# Altium schematic sheet Power.SchDoc
size 431 x 279 mm; Organization: ORGANIZATION; Address1: ADDRESS 1; Address2: ADDRESS 2; Address3: ADDRESS 3; Address4: ADDRESS 4; Revision: -; SheetNumber: 3; SheetTotal: 4; ENG_APP_DATE: --/--/--; DSN_APP_DATE: --/--/--; CHK_APP_DATE: --/--/--
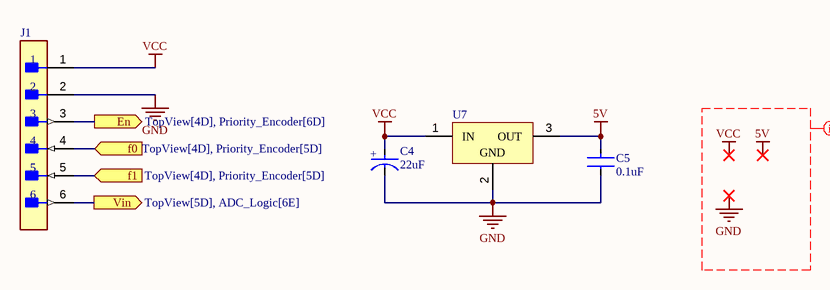
[diagram p0: Power.SchDoc]

## Parts
C4  22uF  [FP-RAD-TH-D_5_0_5-L_11_1-MFG]
C5  0.1uF  [FP-K15H5-MFG]
J1  22-28-4060  [FP-22-28-4060-MFG]  (value not drawn)
U7  MC7805CTG  [ONSC-TO-220-3-221AB-01]  (value not drawn)

## Ports
En (out, see TopView[4D], Priority_Encoder[6D]), f0 (in, see TopView[4D], Priority_Encoder[5D]), f1 (in, see TopView[4D], Priority_Encoder[5D]), Vin (out, see TopView[5D], ADC_Logic[6E])

## Nets
5V: C5.1 U7.3(OUT)
GND: C4.1(C) C5.2 J1.2 U7.2(GND)
VCC: C4.2(A) J1.1 U7.1(IN)
En: J1.3 ; port En
f0: J1.4 ; port f0
f1: J1.5 ; port f1
Vin: J1.6 ; port Vin

## Layout directives
net class Power; rule Width Constraint [Pref Width = 10mil    Min Width = 10mil    Max Width = 10mil]: 5V, GND, VCC

## Notes on the sheet
- Labels drawn without touching a wire or pin: 5V, GND, VCC
- DWG. NO.
- REV.
- SHT.
- THIS DOCUMENT AND THE DATA DISCLOSED HEREIN OR HEREWITH IS THE PROPERTY OF ALTIUM LIMITED AND MAY BE FREELY DISTRIBUTED IN WHOLE. NO RIGHTS ARE RESERVED OR EXPRESS OR IMPLIED WARANTEE GIVEN.
- REVISION
- DESCRIPTION
- DATE
- APPROVED
- ENG:
- APPROVALS
- PROJECT
- DSN:
- CHK:
- REFERENCE DOCUMENTS
- PROJECT REVISION:
- TITLE
- DOCUMENT REVISION:
- DESIGN ITEM:
- BOM:
- FAB DWG:
- PCB DWG:
- ASSY DWG:
- SCALE:
- SIZE
- B
- CAGE CODE
- FILE NAME
- DWG NO.
- SHEET
- OF
- REV
- (in symbol CMP-05427-001989-1) +

## Library data of the parts
C4 = CMP-05427-001989-1: Aluminum Electrolytic Capacitors (Radial Lead Type) AEC-Q200 Qualified 22uF ±20% 50V; Ripple Current: 155mA; Polarity: Polar; ESR (Equivalent Series Resistance): 1.3R; Life (Hours): 1000Hour; Leakage Current: 3uA; Lead Diameter: 0.5mm; Termination: Radial; Radiation Hardening: No; RoHS Compliant: Yes; Case/Package: Radial; Height: 11mm; Package Quantity: 2000; Min Operating Temperature: -55°C; Length: 11mm; Contact Plating: Tin; Series: FC; Voltage Rating: 50V; Diameter: 5mm; Capacitance: 22uF; Features: General Purpose; Max Operating Temperature: 105°C; Tolerance: 20%; Voltage Rating (DC): 50V; Mount: Through Hole; Impedance: 1.3R; Lead Pitch: 0.197inch; Packaging: Tape and Reel; Height - Seated (Max): 0.472inch
C5 = CMP-02417-000078-1: CAP CER 0.1UF 50V X7R RADIAL; Capacitance: 100nF; Tolerance: 10%; Dielectric Material: Ceramic; Lead Length: 30mm; Lead Diameter: 0.5mm; Lead/Base Style: Formed Leads; Diameter: 500um; Max Operating Temperature: 125°C; Case/Package: Dipped; Dielectric: X7R; Lead Free: Lead Free; Construction: RADIAL; Voltage: 50V; Thickness: 2.6mm; Min Operating Temperature: -55°C; Lead Pitch: 5mm; Height: 4mm; Radiation Hardening: No; Voltage Rating: 50V; Depth: 2.5mm; Voltage Rating (DC): 50V; Package Quantity: 1; Weight: 0.005644oz; Series: K; Mount: Through Hole; Termination: Radial; Height - Seated (Max): 0.257inch; Length: 4mm; Packaging: Tape and Reel; Width: 2.5mm; RoHS Compliant: Yes
J1 = CMP-04776-000763-1: CONN HEADER VERT 6POS 2.54MM; Voltage Rating: 250V; Current Rating: 4A; Number of Contacts: 6; Max Voltage Rating (DC): 250.25kV; Gender: Male; Contact Resistance: 20mR; Connector Type: Male Pin; Color: Black; Max Voltage Rating (AC): 250V; Pitch: 2.54mm; Orientation: Straight; Max Operating Temperature: 75°C; Contact Plating: Tin; Depth: 2.49mm; Contact Type: Male Pin; Number of Positions: 6; Length: 15.24mm; Packaging: Bulk; Mount: Through Hole; Housing Material: Thermoplastic; Housing Color: Black; Termination: Solder; Contact Material: Brass; Min Operating Temperature: 0°C; Series: KK® 42375; Number of Rows: 1; Package Quantity: 1; RoHS Compliant: Yes; Contact Mating Length: 0.24inch
U7 = CMP-2000-04928-1: Positive Voltage Regulator, 1 A, 5 V, 0 to 125 degC, 3-Pin TO-220, RoHS, Tube; Manufacturer: ON Semiconductor; Resistance, Thermal, Junction to Case: 5degC/W; Voltage, Supply: 35V; Regulator Function: Standard; Temperature, Operating, Maximum: +125degC; Load Regulation: 25mV; Regulator Type: PositiveVoltageOut; Current, Output, Maximum: 1A; Regulation, Load: 1.3mV; Number of Outputs: 1; Temperature, Operating, Range: 0to+125degC; Regulation, Line: 0.5mV; Line Regulation: 20mV; Voltage, Input Range: Maximumof35V; Output Type: Fixed; Current, Quiescent Supply: 6.5mA; Dropout Voltage: 2V; Temperature, Operating, Minimum: 0degC; Package Version: Rev. A, 11/2010; Current, Supply: 3.2mA; Voltage, Output: 5V; Voltage, Noise: 10μV/V; Package Type: TO-220; Voltage, Input, High Level: 35V; Datasheet URL: http://www.onsemi.com/pub_link/Collateral/MC7800-D.PDF; Dimensions: 10.28x4.82x15.75mm; Width: 4.82mm; Type: VoltageRegulator; Mounting Type: ThroughHole; Polarity: Positive; Datasheet Version: Rev. 27, 11/2014; Height: 15.75mm; Dropout Voltage Measurement Current: 1A; Package Description: 3-Pin Flange Mount, Vertical Straight Lead, Body 9.97 x 4.445 mm, Pitch 2.54 mm; Manufacturer URL: http://www.onsemi.com/; Voltage, Dropout: 2V; Length: 10.28mm; Number of Pins: 3; Package Reference: TO-220-3-221AB-01